# EAGLE design shelves_expander_v10 (EAGLE 9.6.2)
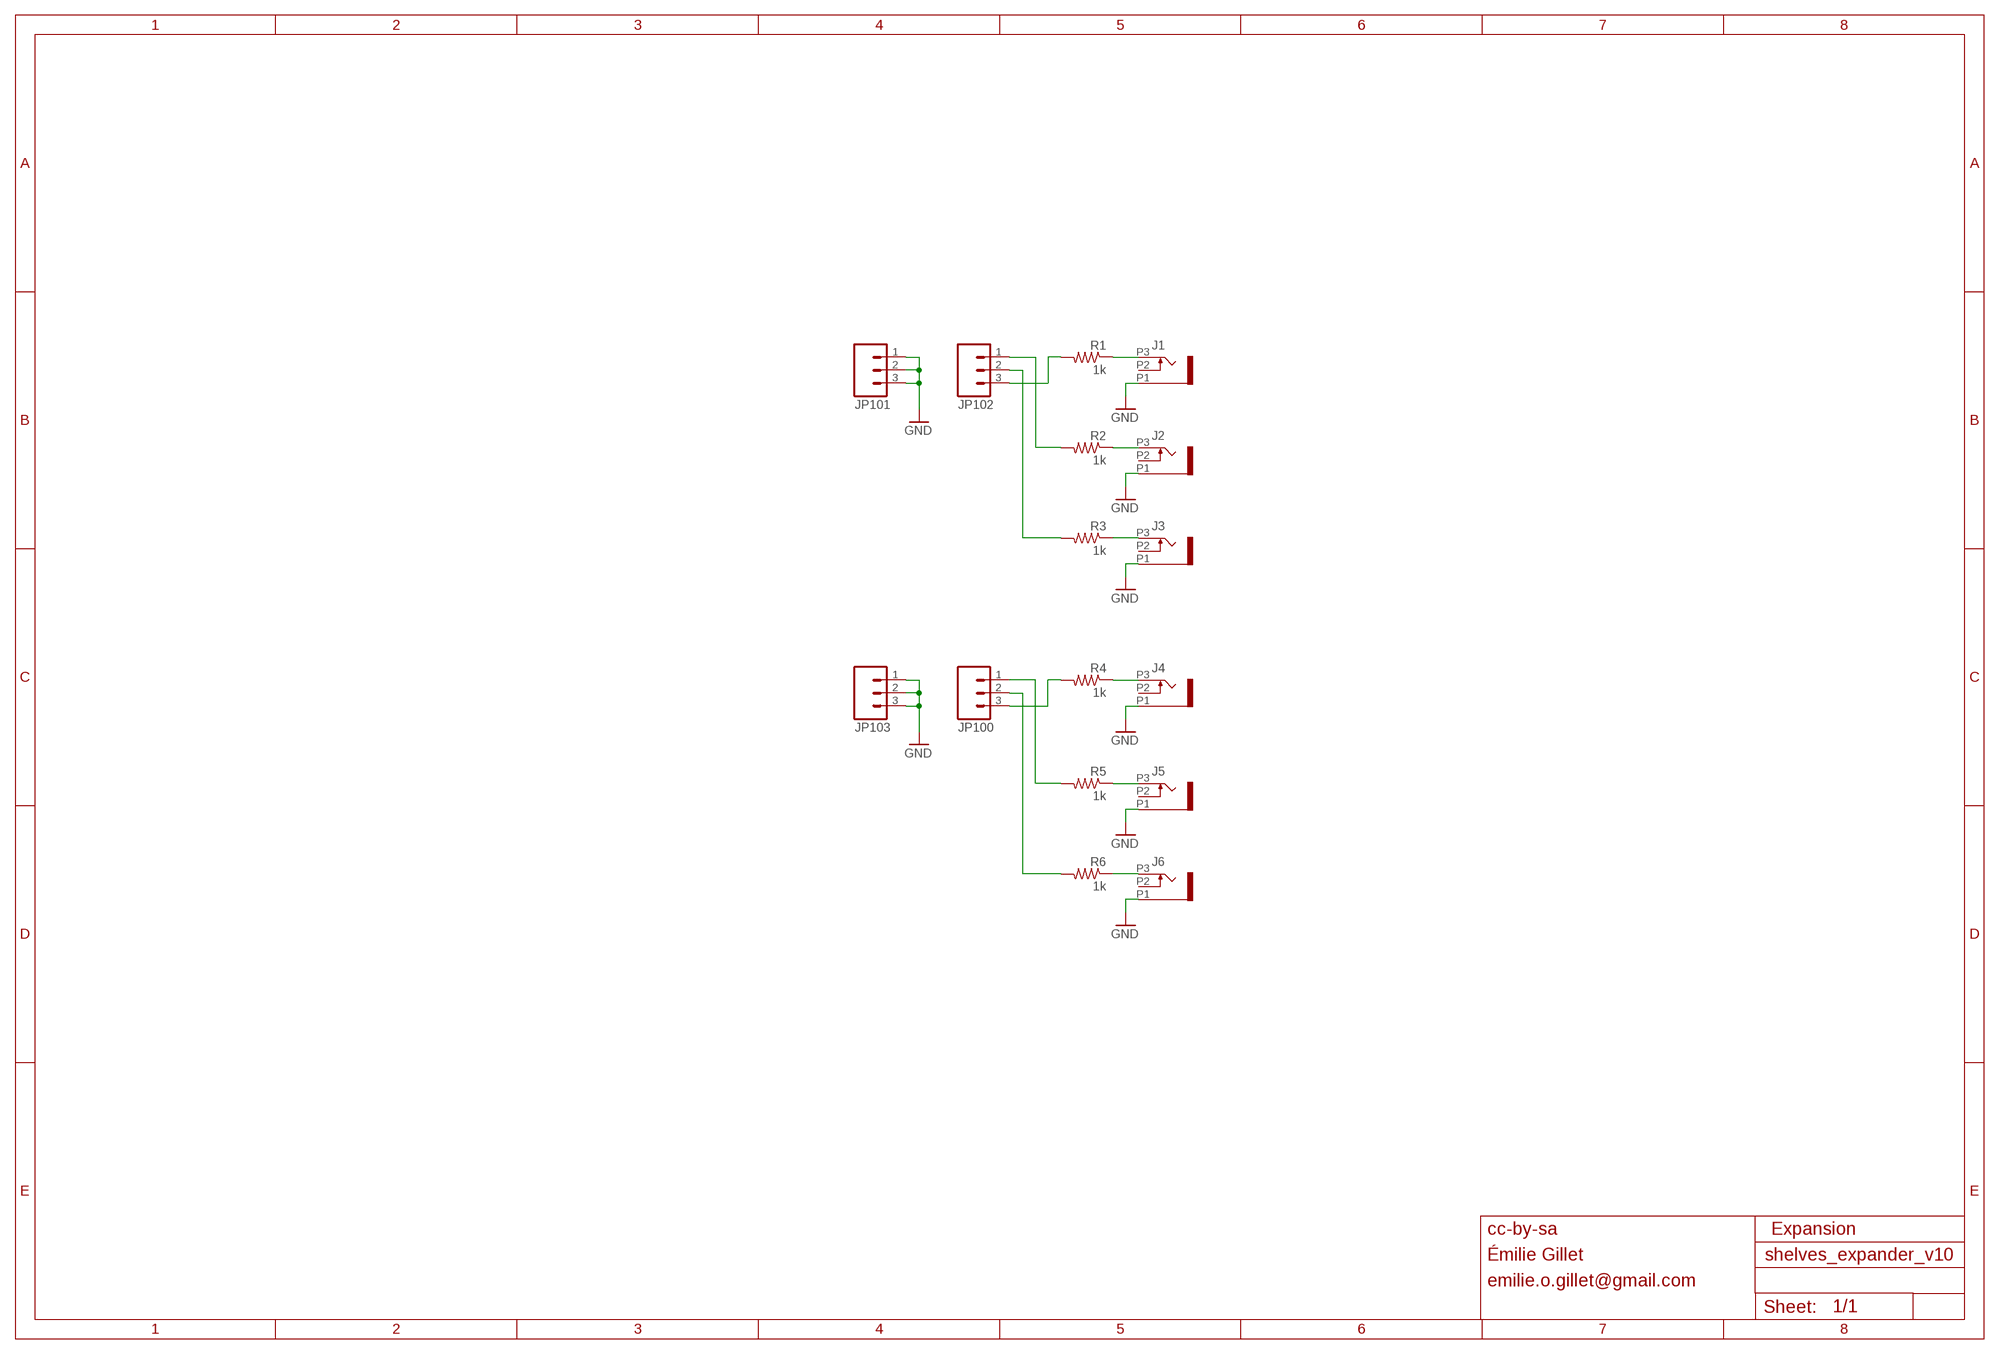
[diagram p0: schematic, sheet 1]

## Parts
J1  PJ301_THONKICONN6  [WQP_PJ_301M6]
J2  PJ301_THONKICONN6  [WQP_PJ_301M6]
J3  PJ301_THONKICONN6  [WQP_PJ_301M6]
J4  PJ301_THONKICONN6  [WQP_PJ_301M6]
J5  PJ301_THONKICONN6  [WQP_PJ_301M6]
J6  PJ301_THONKICONN6  [WQP_PJ_301M6]
JP100  M03PTH  [1X03]
JP101  M03PTH  [1X03]
JP102  M03PTH  [1X03]
JP103  M03PTH  [1X03]
R1  1k  R-US_R0603  [R0603]
R2  1k  R-US_R0603  [R0603]
R3  1k  R-US_R0603  [R0603]
R4  1k  R-US_R0603  [R0603]
R5  1k  R-US_R0603  [R0603]
R6  1k  R-US_R0603  [R0603]

## Nets
BP_1: JP102.1 R2.2
BP_2: JP100.1 R5.2
GND: J1.P1 J2.P1 J3.P1 J4.P1 J5.P1 J6.P1 JP101.1 JP101.2 JP101.3 JP103.1 JP103.2 JP103.3
HP_1: JP102.3 R1.2
HP_2: JP100.3 R4.2
N$1: J4.P3 R4.1
N$2: J1.P3 R1.1
N$3: J6.P3 R6.1
N$4: J2.P3 R2.1
N$5: J5.P3 R5.1
N$6: J3.P3 R3.1
N$8: JP100.2 R6.2
N$9: JP102.2 R3.2
Unconnected: J1.P2 J2.P2 J3.P2 J4.P2 J5.P2 J6.P2

## Notes on the sheet
- cc-by-sa | Expansion
- Émilie Gillet
- emilie.o.gillet@gmail.com

## Library data of the parts
J1-J6 = og-pj301:PJ301_THONKICONN
JP100-JP103 = SparkFun:M03: Header 3 Standard 3-pin 0.1" header. Use with straight break away headers (SKU : PRT-00116), right angle break away headers (PRT-00553), swiss pins (PRT-00743), machine pins (PRT-00117), and female headers (PRT-00115). Molex polarized connector foot print use with SKU : PRT-08232 with associated crimp pins and housings.
R1-R6 = rcl:R-US_: RESISTOR, American symbol

## Board
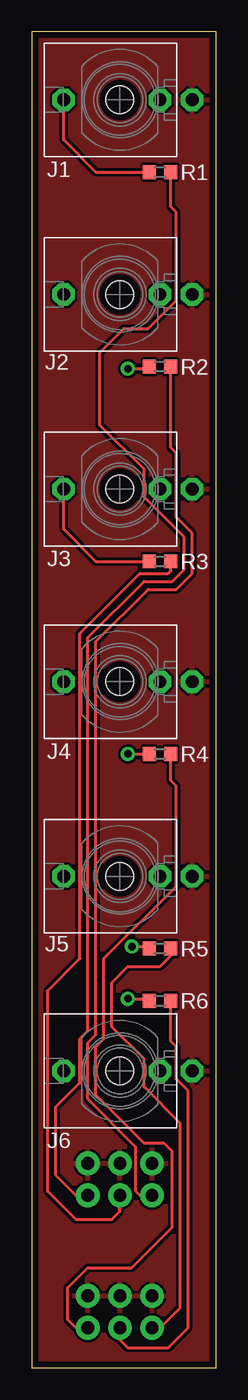
[diagram p1: board, top side]
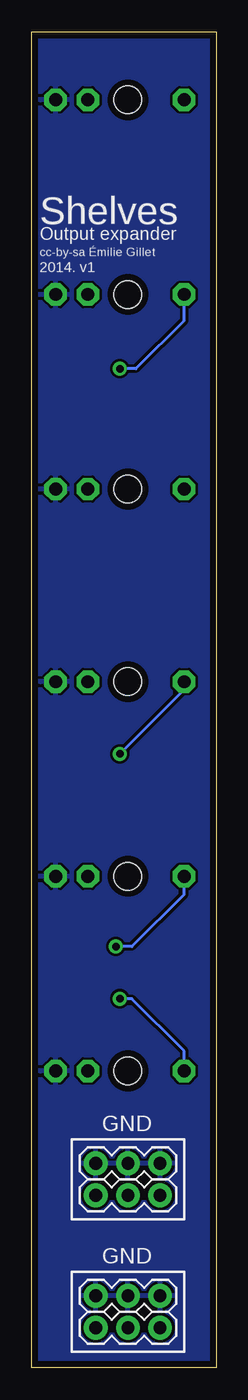
[diagram p2: board, bottom side, seen from below]

Size 14.61 x 105.73 mm. Coordinates in mm from the lower left corner, seen from the top.
Outline: 0,0 14.61,0 14.61,105.73 0,105.73 0,0
Copper layers (1*16): Top 0.035mm / dielectric 1.5mm / Bottom 0.035mm
Design rules "PCBCart-Standard": minimum track width 8mil, minimum drill 0.4mm, track to track 8mil, track to pad 8mil, pad to pad 8mil, via to via 8mil, smd to smd 8mil, copper to edge 20mil, drill to drill 8mil, minimum pad ring 8mil, minimum via ring 10mil, stop-mask expansion 3mil, vias tented up to drill 25mil, thermal gap 8mil

### Footprints (pad centres in the part's own frame; a part is rotated, then mirrored left to right if it is on the bottom)
WQP_PJ_301M6 = drill 1.016 pad 1.778 octagon: P1 0,-5.715; P2 0,-3.175; P3 0,4.445 | hole 2.2: 0,0
1X03 = drill 1.016 pad 1.88: 1 0,0; 2 2.54,0; 3 5.08,0
R0603 = smd 1 x 1.1: 1 -0.85,0; 2 0.85,0

### Placement (x,y rotation side)
J1  6.99,100.33 90 top
J2  6.99,84.93 90 top
J3  6.99,69.53 90 top
J4  6.99,54.29 90 top
J5  6.99,38.89 90 top
J6  6.99,23.5 90 top
JP100  9.53,3.17 0 bottom
JP101  9.53,5.71 0 bottom
JP102  9.53,13.65 0 bottom
JP103  9.53,16.19 0 bottom
R1  10.16,94.61 0 top
R2  10.16,79.22 0 top
R3  10.16,63.82 0 top
R4  10.16,48.58 0 top
R5  10.16,33.18 0 top
R6  10.16,29.05 0 top

### Tracks (layer width: path | path; a pad name or v marks a point on that pad's centre or on a via)
BP_1
  Top 0.254: JP102.1 8.57,13.65 8.26,13.97 8.26,17.46 4.45,21.27 4.45,25.72 5.08,26.35 5.08,57.47 9.21,61.59 11.43,61.59 12.7,62.87 12.7,66.04 11.43,67.31 11.43,72.39 11.01,72.81 R2.2
BP_2
  Top 0.254: JP100.1 10.16,3.17 11.75,4.76 11.75,19.37 8.89,22.23 8.89,24.45 6.35,26.99 6.35,30.48 7.62,31.75 10.16,31.75 11.01,32.6 R5.2
GND
  pour Bottom: 0,105.73 0,0 14.61,0 14.61,105.73
  pour Top (isolate 0.203): 0,105.73 0,0 14.61,0 14.61,105.73
HP_1
  Top 0.254: JP102.3 3.49,13.65 1.91,15.24 1.91,20.64 3.81,22.54 3.81,26.04 4.45,26.67 4.45,57.78 8.89,62.23 11.11,62.23 12.06,63.18 12.06,65.72 8.89,68.9 8.89,71.12 5.4,74.61 5.4,80.33 7.3,82.23 9.21,82.23 11.43,84.45 11.43,91.44 11.01,91.86 R1.2
HP_2
  Top 0.254: JP100.3 3.49,3.17 2.86,3.81 2.86,6.35 4.45,7.94 7.94,7.94 11.11,11.11 11.11,17.14 10.48,17.78 8.89,17.78 5.08,21.59 5.08,25.4 5.71,26.04 5.71,32.38 11.43,38.1 11.43,46.04 11.01,46.46 R4.2
N$1  (via drill 0.6)
  Top 0.254: v7.62,48.58 R4.1
  Bottom 0.254: v7.62,48.58 2.54,53.66 J4.P3
N$2
  Top 0.254: R1.1 5.08,94.61 2.54,97.16 J1.P3
N$3  (via drill 0.6)
  Top 0.254: R6.1 9.15,29.21 v7.62,29.21
  Bottom 0.254: v7.62,29.21 6.67,29.21 2.54,25.08 J6.P3
N$4  (via drill 0.6)
  Top 0.254: R2.1 9.15,79.06 v7.62,79.06
  Bottom 0.254: v7.62,79.06 6.35,79.06 2.54,82.87 J2.P3
N$5  (via drill 0.6)
  Top 0.254: R5.1 9.15,33.34 v7.94,33.34
  Bottom 0.254: v7.94,33.34 6.67,33.34 2.54,37.47 J5.P3
N$6
  Top 0.254: R3.1 5.08,63.82 2.54,66.36 J3.P3
N$8
  Top 0.254: JP100.2 6.99,2.22 7.62,1.59 10.79,1.59 12.38,3.17 12.38,21.91 11.43,22.86 11.43,25.4 11.01,25.82 R6.2
N$9
  Top 0.254: JP102.2 6.99,12.38 6.35,11.75 3.49,11.75 1.27,13.97 1.27,29.84 3.81,32.38 3.81,58.1 8.57,62.87 10.79,62.87 11.01,63.08 R3.2

### Text on the board
bNames: Shelves | Output expander | cc-by-sa Émilie Gillet | 2014. v1 | GND | GND